# Altium schematic sheet 30to50V-24V_10A_2.SchDoc
size 279 x 215 mm; SheetNumber: 2; SheetTotal: 3
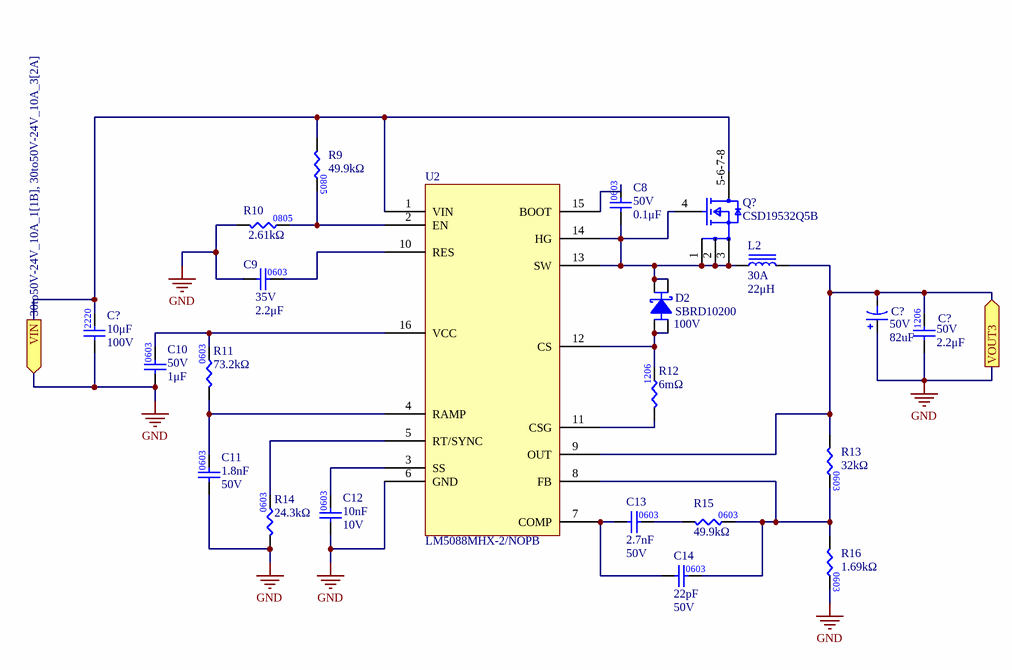
[diagram p0: 30to50V-24V_10A_2.SchDoc]

## Parts
(Parts that share a designator on the sheet are numbered #1, #2 ... from top to bottom, then left to right.)
C8  value 0.1μF  Voltage Rating: 50V  [CAP0603]  (hidden comment: CAP_0.1uF_50V_0603)
C9  value 2.2μF  Voltage Rating: 35V  [CAP0603]  (hidden comment: CAP_2.2uF_35V_0603)
C10  value 1μF  Voltage Rating: 50V  [CAP0603]  (hidden comment: CAP_1uF_50V_0603)
C11  value 1.8nF  Voltage Rating: 50V  [CAP0603]  (hidden comment: CAP_1.8nF_50V_0603)
C12  value 10nF  Voltage Rating: 10V  [CAP0603]  (hidden comment: CAP_10nF_25V_0603)
C13  value 2.7nF  Voltage Rating: 50V  [CAP0603]  (hidden comment: CAP_2.7nF_50V_0603)
C14  value 22pF  Voltage Rating: 50V  [CAP0603]  (hidden comment: CAP_22pF_50V_0603)
C?#1  Voltage Rating: 50V  Capacitance: 82uF  [RADIAL_CORNELL_D]  (hidden comment: CAP_47uF_100V_ALUM)
C?#2  value 10μF  Voltage Rating: 100V  [C5750X7S2A106M230KB]  (hidden comment: CAP_10uF_50V_2220)
C?#3  value 2.2μF  Voltage Rating: 50V  [CAP1206]  (hidden comment: CAP_2.2uF_50V_1206)
D2  Manufacturer Part Number 1: SBRD10200  Vr (Max): 100V  [D-PAK]  (hidden comment: DIO_SCHOTTKY_100V_5.5A)
L2  Current Rating: 30A  Inductance: 22μH  [IND_VISHAY_IHLP6767GZ51]  (hidden comment: IND_22uH_30A)
Q?  CSD19532Q5B  [FP-DNK0008A-MFG]
R9  value 49.9kΩ  [RES0805]  (hidden comment: RES_49.9kΩ_0805_1%)
R10  value 2.61kΩ  [RES0805]  (hidden comment: RES_2.61kΩ_0805_1%)
R11  value 73.2kΩ  [RES0603]  (hidden comment: RES_73.2kΩ_0603_1%)
R12  value 6mΩ  [RES1206]  (hidden comment: RES_0.006Ω_1206_1%)
R13  value 32kΩ  [RES0603]  (hidden comment: RES_32KΩ_0603_0.1%)
R14  value 24.3kΩ  [RES0603]  (hidden comment: RES_24.3kΩ_0603_1%)
R15  value 49.9kΩ  [RES0603]  (hidden comment: RES_49.9kΩ_0603_1%)
R16  value 1.69kΩ  [RES0603]  (hidden comment: RES_1.69kΩ_0603_1%)
U2  LM5088  (value not drawn)

## Ports
VIN (in, see 30to50V-24V_10A_1[1B], 30to50V-24V_10A_3[2A]), VOUT3 (out)

## Nets
GND: C9.1 C10.1 C11.1 C12.1 C?#1.1 C?#1.2 C?#2.1 C?#2.2 C?#3.1 C?#3.2 L2.2 Q?.5-6-7-8(D) R9.1 R10.1 R13.1 R14.1 R16.2 U2.1(VIN) U2.6(GND) U2.9(OUT) ; port VIN, port VOUT3
NetC8_1: C8.1 D2.2(Cathode) D2.4(Cathode) L2.1 Q?.1(S) Q?.2(S) Q?.3(S) Q?.4(G) U2.13(SW) U2.14(HG)
NetC8_2: C8.2 U2.15(BOOT)
NetC9_2: C9.2 U2.10(RES)
NetC10_2: C10.2 R11.2 U2.16(VCC)
NetC11_2: C11.2 R11.1 U2.4(RAMP)
NetC12_2: C12.2 U2.3(SS)
NetC13_1: C13.1 C14.1 U2.7(COMP)
NetC13_2: C13.2 R15.1
NetC14_2: C14.2 R13.2 R15.2 R16.1 U2.8(FB)
NetD2_1: D2.1(Anode) D2.3(Anode) R12.2 U2.12(CS)
NetR9_2: R9.2 R10.2 U2.2(EN)
NetR12_1: R12.1 U2.11(CSG)
NetR14_2: R14.2 U2.5(RT/SYNC)

## Notes on the sheet
- University of Waterloo Robotics Team
- 200 University Ave W
- REV
- PROJECT
- Waterloo, Ontario, Canada
- N2L 3G1
- DOCUMENT
- ENGINEER
- REVIEWER
- MODIFIED
- SHEET
- OF
- (in symbol CAP_1.8nF_50V_0603) 0603
- (in symbol CAP_1uF_50V_0603) 0603
- (in symbol CAP_2.2uF_35V_0603) 0603
- (in symbol CAP_2.2uF_50V_1206) 1206
- (in symbol CAP_2.7nF_50V_0603) 0603
- (in symbol CAP_10nF_25V_0603) 0603
- (in symbol CAP_10uF_50V_2220) 2220
- (in symbol CAP_22pF_50V_0603) 0603
- (in symbol RES_1.69kΩ_0603_1%) 0603
- (in symbol RES_49.9kΩ_0603_1%) 0603

## Library data of the parts
C8 = CAP_0.1uF_50V_0603: CAP CER 0.1UF 50V X7R 0603; Manufacturer Part Number 1: CC0603KRX7R9BB104; Manufacturer 1: Yageo; Package/Footprint: 0603; Supplier Part Number 1: 311-1344-1-ND; Supplier 1: Digi-Key; Mounting Type: SMD; Dielectric: X7R
C9 = CAP_2.2uF_35V_0603: CAP CER 2.2UF 35V X5R 0603; Manufacturer Part Number 1: C1608X5R1V225K080AC; Manufacturer 1: TDK Corporation; Dielectric: 5; Supplier Part Number 1: 445-8025-1-ND; Supplier 1: Digi-Key
C10 = CAP_1uF_50V_0603: CAP CER 1UF 50V X6S 0603; Manufacturer Part Number 1: C1608X6S1H105K080AC; Manufacturer 1: TDK Corporation; Supplier Part Number 1: 445-7424-1-ND; Supplier 1: Digi-Key; Dielectric: X6S
C11 = CAP_1.8nF_50V_0603: CAP CER 1800PF 50V C0G/NP0 0603; Manufacturer Part Number 1: GRM1885C1H182JA01J; Manufacturer 1: Murata Electronics; Dielectric: C0G; Supplier Part Number 1: 490-6380-1-ND; Supplier 1: Digi-Key
C12 = CAP_10nF_25V_0603: CAP CER 10000PF 25V C0G 0603; Manufacturer Part Number 1: C1608C0G1E103J080AA; Manufacturer 1: Yageo; Supplier Part Number 1: 445-2664-1-ND; Supplier 1: Digi-Key; Dielectric: C0G
C13 = CAP_2.7nF_50V_0603: CAP CER 2700PF 50V X7R 0603; Manufacturer Part Number 1: GRM1885C1H272JA01D; Manufacturer 1: Murata Electronics; Dielectric: C0G; Supplier Part Number 1: 490-3283-1-ND; Supplier 1: Digi-Key
C14 = CAP_22pF_50V_0603: CAP CER 22PF 50V C0G/NPO 0603; Manufacturer Part Number 1: CC0603JRNPO9BN220; Manufacturer 1: Yageo; Dielectric: C0G; Supplier Part Number 1: 311-1062-1-ND; Supplier 1: Digi-Key
C?#1 = CAP_47uF_100V_ALUM: Aluminum Electrolytic Capacitor, Polarized, Aluminum (wet), 100V, 20% +Tol, 20% -Tol, 47uF, Surface Mount, 5454; Manufacturer: Nichicon; Manufacturer Part Number: UCD2A470MNQ1MS; Dielectric Material: Aluminium; Leakage Current: 47uA; Ripple Current: 250mA; Tan Delta: 0.07; ComponentLink1URL: https://datasheet.ciiva.com:443/pdfs/VipMasterIC/IC/NICH/NICH-S-A0003527725/NICH-S-A0003527725-1.pdf?src-supplier=IHS+Markit; ComponentLink1Description: https://datasheet.ciiva.com:443/pdfs/VipMasterIC/IC/NICH/NICH-S-A0003527725/NICH-S-A0003527725-1.pdf?src-supplier=IHS+Markit; ComponentLink2URL: https://datasheet.ciiva.com/11776/0900766b80ebdadd-11776792.pdf?src-supplier=RSComponents; ComponentLink2Description: https://datasheet.ciiva.com/11776/0900766b80ebdadd-11776792.pdf?src-supplier=RSComponents; ComponentLink3URL: https://datasheet.ciiva.com/30526/getdatasheetpartid-513218-30526979.pdf?src-supplier=Verical; ComponentLink3Description: https://datasheet.ciiva.com/30526/getdatasheetpartid-513218-30526979.pdf?src-supplier=Verical; ComponentLink4URL: https://datasheet.ciiva.com/16389/e-cd-16389182.pdf?src-supplier=Future+Electronics; ComponentLink4Description: https://datasheet.ciiva.com/16389/e-cd-16389182.pdf?src-supplier=Future+Electronics; ComponentLink5URL: https://datasheet.ciiva.com/17523/e-cd-17523974.pdf?src-supplier=Avnet+Europe; ComponentLink5Description: https://datasheet.ciiva.com/17523/e-cd-17523974.pdf?src-supplier=Avnet+Europe; ComponentLink6URL: https://datasheet.ciiva.com/6326/e-cd-6326630.pdf?src-supplier=Digi-Key; ComponentLink6Description: https://datasheet.ciiva.com/6326/e-cd-6326630.pdf?src-supplier=Digi-Key; ComponentLink7URL: https://datasheet.ciiva.com/6326/e-cd-6326632.pdf?src-supplier=Digi-Key; ComponentLink7Description: https://datasheet.ciiva.com/6326/e-cd-6326632.pdf?src-supplier=Digi-Key; ComponentLink8URL: https://datasheet.ciiva.com/6326/e-cd-6326634.pdf?src-supplier=Digi-Key; ComponentLink8Description: https://datasheet.ciiva.com/6326/e-cd-6326634.pdf?src-supplier=Digi-Key; Supplier 1: Digi-Key; RoHS: Yes; Category: Aluminum Electrolytic Capacitors; Stock 1: 515; Pricing 1: 1=2.15000, 10=1.69800, 50=1.47140, 100=1.27330 (USD); Mount: Surface Mount; Number of Pins: 2; Package Shape: Cylindrical; Size Code: 7575; Terminal Finish: Copper; Min Operating Temperature: -55°C; Max Operating Temperature: 105°C; JESD-609 Code: e3; Polarity: Polarized; Capacitor Type: Aluminium; Negative Tolerance: 20%; Package Style: SMTMeter; Packaging: Tape and Reel; Positive Tolerance: 20%; Rated DC Voltage (URdc): 100V; Termination: Flat; Length: 14.6mm; Width: 13.6mm; Height: 13.5mm; REACH SVHC: Yes; RoHS Compliant: Yes; Supplier Part Number 1: 493-6201-1-ND
C?#2 = CAP_10uF_50V_2220: CAP CER 10UF 100V X7S 2220; Manufacturer 1: TDK Corporation; Dielectric: X7R; Supplier 1: Digi-Key; Supplier Part Number 1: 445-5212-1-ND; Manufacturer Part Number 1: C5750X7S2A106M230KB
C?#3 = CAP_2.2uF_50V_1206: CAP CER 2.2UF 50V X7R 1206; Manufacturer 1: Murata Electronics; Manufacturer Part Number 1: GCM31CR71H225KA55L; Supplier Part Number 1: 490-4796-1-ND; Supplier 1: Digi-Key; Dielectric: X7R
D2 = DIO_SCHOTTKY_200V_10A: DIODE SCHOTTKY 200V 10A DPAK; Manufacturer 1: SMC Diode Solutions; Package/Footprint: TO-252-3, DPak (2 Leads + Tab), SC-63; Supplier 1: Digi-Key; Supplier Part Number 1: 1655-SBRD10200CT-ND; Mounting Type: SMD
L2 = IND_22uH_30A: FIXED IND 22UH 30A 2.4 MOHM SMD; Manufacturer 1: Würth Elektronik; Manufacturer Part Number 1: 7443642200; DC Resistance (DCR): 2.4mR; Inductance Tolerance: 15%; Saturation Current: 30A; Supplier 1: Digi-Key; Supplier Part Number 1: 732-5628-ND; Mounting Type: SMD
Q? = CMP-04962-000007-1: MOSFET N-CH 100V 100A 8SON; Manufacturer: Texas Instruments; Depletion Mode: False; Number Of Channels: 1; Gate To Source Voltage: 20V; Reverse Recovery Time: 80ns; Input Capacitace At Vds: 3700pF @ 50V; Max Forward Diode Voltage: 1V; Turn Off Delay Time: 22ns; Drain To Source Resistance: 4.6mΩ; Threshold Vgs Max: 3.2V; Max Junction Temp: +150°C; Turn On Delay Time: 7ns; Pulse Drain Current: 400A; Rthja Max: 50°C/W; Typ Forward Diode Voltage: 0.8V; Reverse Recovery Charge: 249nC; Threshold Vgs Min: 2.2V; Gate Charge At Vgs: 48nC @ 10V; Power Dissipation: 3.1W; Transconductance: 84S; Temperature Range Low: -55°C; Automotive: No; RoHS: TRUE; Temperature: -55°C to +150°C; Device Class L3: MOSFETs; Continuous Drain Current: 100A; Number Of N Channels: 1; Height: 1.05mm; Mouser Description: MOSFET 100V 4.0 mOhm N-Ch NexFET Power MOSFET; Drain To Source Voltage: 100V; Temperature Range High: +150°C; Manufacturer Part Number: CSD19532Q5B; Octopart: https://octopart.com/csd19532q5b-texas+instruments-32890191; ComponentLink2URL: http://www.ti.com/lit/ds/symlink/csd19532q5b.pdf; Lead Free: Yes; Drain To Source Breakdown Voltage: 100V; Device Class L1: Discrete Semiconductors; Device Class L2: Transistors; Package: DNK0008A; Digikey Description: MOSFET N-CH 100V 100A 8SON; Category: Trans; ComponentLink2Description: Datasheet
R9 = RES_49.9kΩ_0805_1%: RES 49.9K OHM 1% 1/8W 0805; Manufacturer 1: Vishay Dale; Manufacturer Part Number 1: TNPW080549K9BEEN; Package/Footprint: 0805; Supplier 1: Digi-Key; Mounting Type: SMD; Supplier Part Number 1: 541-3802-1-ND; LCSC Part #: C17719
R10 = RES_2.61kΩ_0805_1%: RES 2.61K OHM 1% 1/8W 0805; Manufacturer 1: Vishay Dale; Manufacturer Part Number 1: RC0805FR-072K61L; Package/Footprint: 0805; Supplier 1: Digi-Key; Mounting Type: SMD; Supplier Part Number 1: 311-2.61KCRCT-ND
R11 = RES_73.2kΩ_0603_1%: RES 73.2K OHM 1% 1/10W 0603; Manufacturer 1: YAGEO; Manufacturer Part Number 1: RC0603FR-0773K2L; Power: 0.1W; Supplier Part Number 1: 311-73.2KHRCT-ND; Supplier 1: Digi-Key; Package: 0603; Tolerance: 1%
R12 = RES_0.006Ω_1206_1%: RES 0.006 OHM 1% 1W 1206; Manufacturer 1: Rohm Semiconductor; Package/Footprint: 1206; Manufacturer Part Number 1: Rohm Semiconductor; Mounting Type: SMD; Supplier 1: Digi-Key; Supplier Part Number 1: RHM.006ALCT-ND
R13 = RES_32KΩ_0603_0.1%: RES SMD 32K OHM 0.1% 1/10W 0603; Manufacturer 1: Yageo; Manufacturer Part Number 1: RT0603BRD0732KL; Supplier Part Number 1: 13-RT0603BRD0732KLCT-ND; Supplier 1: Digi-Key; Mounting Type: SMD; Package: 0603
R14 = RES_24.3kΩ_0603_1%: RES 24.3K OHM 1% 1/10W 0603; Manufacturer 1: YAGEO; Manufacturer Part Number 1: RC0603FR-0724K3L; Power: 0.1W; Supplier Part Number 1: 311-24.3KHRCT-ND; Supplier 1: Digi-Key; Package: 0603; Tolerance: 1%
R15 = RES_49.9kΩ_0603_1%: RES 49.9K OHM 1% 1/10W 0603; Manufacturer Part Number 1: RK73H1JTTD4992F; Manufacturer 1: KOA Speer Electronics, Inc.; Supplier 1: Digi-Key; Supplier Part Number 1: 2019-RK73H1JTTD4992FCT-ND; Mounting Type: SMD
R16 = RES_1.69kΩ_0603_1%: RES 1.69K OHM 1% 1/10W 0603; Manufacturer 1: Yageo; Manufacturer Part Number 1: RC0603FR-071K69L; Supplier 1: Digi-Key; Supplier Part Number 1: 311-1.69KHRCT-ND
U2 = LM5088MHX-2/NOPB: IC REG CTRLR BUCK 16HTSSOP; Manufacturer 1: Texas Instruments; Supply Voltage: 4.5V - 75V; Switching Frequency: 50kHz - 1MHz; Supplier 1: Digi-Key; Supplier Part Number 1: 296-35302-1-ND; Package: 16-HTSSOP; Manufacturer Part Number 1: LM5088MHX-2/NOPB